# Altium schematic sheet Sheet1.SchDoc
size A; SheetNumber: 1; SheetTotal: 1
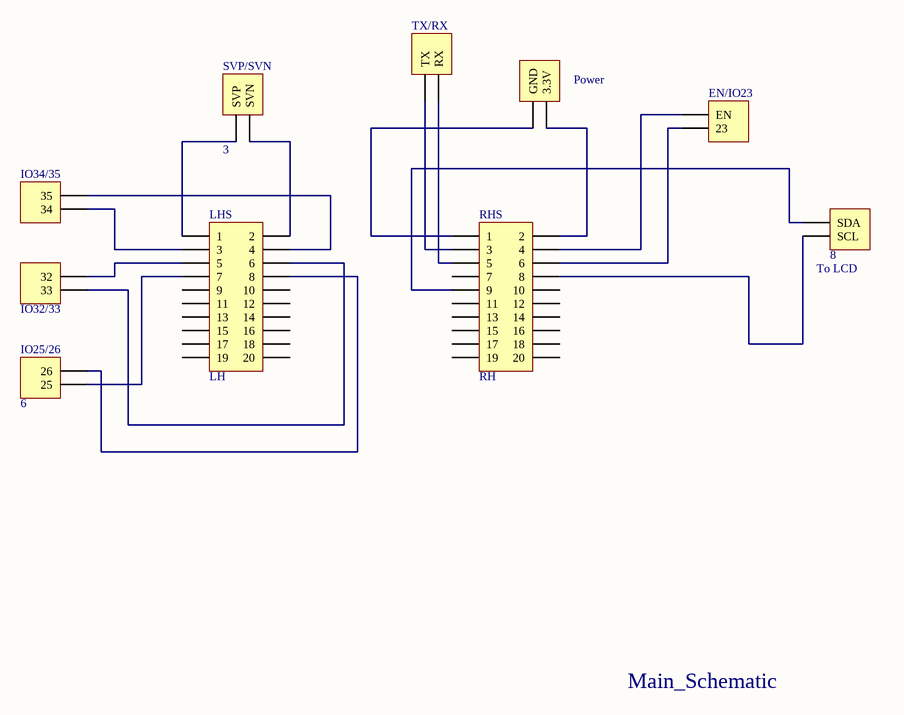
[diagram p0: Sheet1.SchDoc]

## Parts
EN/IO23  7  [HDR1X2]  (value not drawn)
IO25/26  6  [HDR1X2]
IO32/33  5  [HDR1X2]  (value not drawn)
IO34/35  4  [HDR1X2]  (value not drawn)
LHS  LH  [HDR2X10]
Power  1  [HDR1X2]  (value not drawn)
RHS  RH  [HDR2X10]
SVP/SVN  3  [HDR1X2]
To_LCD  8  [HDR1X2]
TX/RX  2  [HDR1X2]  (value not drawn)

## Nets
NetEN/IO23_1: EN/IO23.1(EN) RHS.4
NetEN/IO23_2: EN/IO23.2(23) RHS.6
NetIO25/26_1: IO25/26.1(25) LHS.7
NetIO25/26_2: IO25/26.2(26) LHS.8
NetIO32/33_1: IO32/33.1(33) LHS.6
NetIO32/33_2: IO32/33.2(32) LHS.5
NetIO34/35_1: IO34/35.1(34) LHS.3
NetIO34/35_2: IO34/35.2(35) LHS.4
NetLHS_1: LHS.1 SVP/SVN.1(SVP)
NetLHS_2: LHS.2 SVP/SVN.2(SVN)
NetPower_1: Power.1(GND) RHS.1
NetPower_2: Power.2(3.3V) RHS.2
NetRHS_3: RHS.3 TX/RX.1(TX)
NetRHS_5: RHS.5 TX/RX.2(RX)
NetRHS_8: RHS.8 To_LCD.2(SCL)
NetRHS_9: RHS.9 To_LCD.1(SDA)

Not connected (* = marked no-connect by the designer): LHS 9 10 11 12 13 14 15 16 17 18 19 20; RHS 7 10 11 12 13 14 15 16 17 18 19 20

## Notes on the sheet
- Main_Schematic
- Text

## Library data of the parts
EN/IO23 IO25/26 IO32/33 IO34/35 Power SVP/SVN To_LCD TX/RX = CMP-307-000070-1: Header, 2-Pin; Signal Integrity: Connector; Design Item ID: Header 2; Publisher: Altium Limited; Source: Miscellaneous Connectors.SchLib; LatestRevisionNote: Re-released for DXP Platform.; Pin Count: 2; Component Type: Standard; LatestRevisionDate: 17-Jul-2002
LHS RHS = CMP-307-000024-1: Header, 10-Pin, Dual row; Signal Integrity: Connector; LatestRevisionNote: Re-released for DXP Platform.; Source: Miscellaneous Connectors.SchLib; Publisher: Altium Limited; Design Item ID: Header 10X2; Pin Count: 20; LatestRevisionDate: 17-Jul-2002; Component Type: Standard